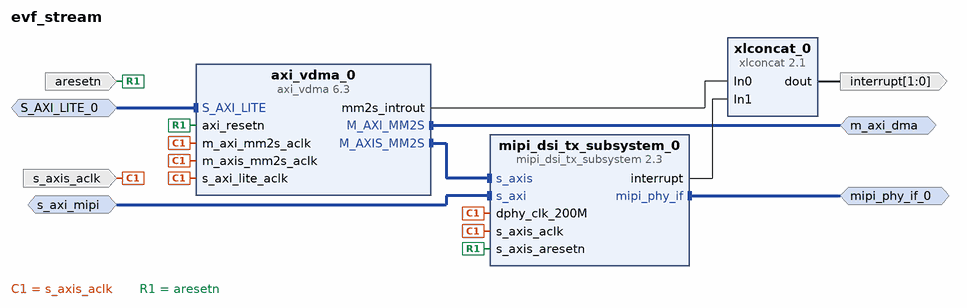
[diagram p0: block diagram of the top level]
# Vivado block design evf_stream, xc7z014sclg484-1, Vivado 2023.1
create_bd_design evf_stream

create_bd_intf_port -mode Master -vlnv xilinx.com:interface:mipi_phy_rtl:1.0 mipi_phy_if_0
create_bd_intf_port -mode Master -vlnv xilinx.com:interface:aximm_rtl:1.0 m_axi_dma
set_property -dict [list \
  CONFIG.ADDR_WIDTH 32 \
  CONFIG.DATA_WIDTH 128 \
  CONFIG.FREQ_HZ 200000000 \
  CONFIG.HAS_BRESP 0 \
  CONFIG.HAS_BURST 0 \
  CONFIG.HAS_LOCK 0 \
  CONFIG.HAS_QOS 0 \
  CONFIG.HAS_REGION 0 \
  CONFIG.HAS_WSTRB 0 \
  CONFIG.NUM_READ_OUTSTANDING 16 \
  CONFIG.NUM_WRITE_OUTSTANDING 2 \
  CONFIG.PROTOCOL AXI4 \
  CONFIG.READ_WRITE_MODE READ_ONLY \
] [get_bd_intf_ports m_axi_dma]
create_bd_intf_port -mode Slave -vlnv xilinx.com:interface:aximm_rtl:1.0 s_axi_mipi
set_property -dict [list \
  CONFIG.ADDR_WIDTH 16 \
  CONFIG.ARUSER_WIDTH 0 \
  CONFIG.AWUSER_WIDTH 0 \
  CONFIG.BUSER_WIDTH 0 \
  CONFIG.DATA_WIDTH 32 \
  CONFIG.FREQ_HZ 200000000 \
  CONFIG.HAS_BRESP 1 \
  CONFIG.HAS_BURST 0 \
  CONFIG.HAS_CACHE 0 \
  CONFIG.HAS_LOCK 0 \
  CONFIG.HAS_PROT 0 \
  CONFIG.HAS_QOS 0 \
  CONFIG.HAS_REGION 0 \
  CONFIG.HAS_RRESP 1 \
  CONFIG.HAS_WSTRB 1 \
  CONFIG.ID_WIDTH 0 \
  CONFIG.MAX_BURST_LENGTH 1 \
  CONFIG.NUM_READ_OUTSTANDING 1 \
  CONFIG.NUM_READ_THREADS 1 \
  CONFIG.NUM_WRITE_OUTSTANDING 1 \
  CONFIG.NUM_WRITE_THREADS 1 \
  CONFIG.PROTOCOL AXI4LITE \
  CONFIG.READ_WRITE_MODE READ_WRITE \
  CONFIG.RUSER_BITS_PER_BYTE 0 \
  CONFIG.RUSER_WIDTH 0 \
  CONFIG.SUPPORTS_NARROW_BURST 0 \
  CONFIG.WUSER_BITS_PER_BYTE 0 \
  CONFIG.WUSER_WIDTH 0 \
] [get_bd_intf_ports s_axi_mipi]
create_bd_intf_port -mode Slave -vlnv xilinx.com:interface:aximm_rtl:1.0 S_AXI_LITE_0
set_property -dict [list \
  CONFIG.ADDR_WIDTH 9 \
  CONFIG.ARUSER_WIDTH 0 \
  CONFIG.AWUSER_WIDTH 0 \
  CONFIG.BUSER_WIDTH 0 \
  CONFIG.DATA_WIDTH 32 \
  CONFIG.FREQ_HZ 200000000 \
  CONFIG.HAS_BRESP 1 \
  CONFIG.HAS_BURST 0 \
  CONFIG.HAS_CACHE 0 \
  CONFIG.HAS_LOCK 0 \
  CONFIG.HAS_PROT 0 \
  CONFIG.HAS_QOS 0 \
  CONFIG.HAS_REGION 0 \
  CONFIG.HAS_RRESP 1 \
  CONFIG.HAS_WSTRB 0 \
  CONFIG.ID_WIDTH 0 \
  CONFIG.MAX_BURST_LENGTH 1 \
  CONFIG.NUM_READ_OUTSTANDING 2 \
  CONFIG.NUM_READ_THREADS 1 \
  CONFIG.NUM_WRITE_OUTSTANDING 2 \
  CONFIG.NUM_WRITE_THREADS 1 \
  CONFIG.PROTOCOL AXI4LITE \
  CONFIG.READ_WRITE_MODE READ_WRITE \
  CONFIG.RUSER_BITS_PER_BYTE 0 \
  CONFIG.RUSER_WIDTH 0 \
  CONFIG.SUPPORTS_NARROW_BURST 0 \
  CONFIG.WUSER_BITS_PER_BYTE 0 \
  CONFIG.WUSER_WIDTH 0 \
] [get_bd_intf_ports S_AXI_LITE_0]
create_bd_port -dir I -type rst aresetn
create_bd_port -dir I -type clk s_axis_aclk
set_property -dict [list \
  CONFIG.ASSOCIATED_BUSIF m_axi_dma:s_axi_mipi:S_AXI_LITE_0 \
  CONFIG.ASSOCIATED_RESET aresetn \
  CONFIG.FREQ_HZ 200000000 \
] [get_bd_ports s_axis_aclk]
create_bd_port -dir O -from 1 -to 0 interrupt

create_bd_cell -type ip -vlnv xilinx.com:ip:mipi_dsi_tx_subsystem:2.3 mipi_dsi_tx_subsystem_0
set_property -dict [list \
  CONFIG.C_EN_7S_LINERATE_CHECK true \
  CONFIG.C_EN_HS_OBUFTDS false \
  CONFIG.C_INCLUDE_DCS_CMD_MODE false \
  CONFIG.DPHY_EN_REG_IF false \
  CONFIG.DSI_DATATYPE RGB888 \
  CONFIG.DSI_LANES 4 \
  CONFIG.DSI_PIXELS 4 \
  CONFIG.SupportLevel 1 \
] [get_bd_cells mipi_dsi_tx_subsystem_0]
create_bd_cell -type ip -vlnv xilinx.com:ip:xlconcat:2.1 xlconcat_0
create_bd_cell -type ip -vlnv xilinx.com:ip:axi_vdma:6.3 axi_vdma_0
set_property -dict [list \
  CONFIG.c_include_s2mm 0 \
  CONFIG.c_m_axis_mm2s_tdata_width 96 \
  CONFIG.c_mm2s_genlock_mode 0 \
  CONFIG.c_num_fstores 1 \
] [get_bd_cells axi_vdma_0]

# ---- connections ----

connect_bd_intf_net -intf_net S_AXI_LITE_0_1 [get_bd_intf_ports S_AXI_LITE_0] [get_bd_intf_pins axi_vdma_0/S_AXI_LITE]
connect_bd_intf_net [get_bd_intf_pins axi_vdma_0/M_AXIS_MM2S] [get_bd_intf_pins mipi_dsi_tx_subsystem_0/s_axis]
connect_bd_intf_net [get_bd_intf_ports m_axi_dma] [get_bd_intf_pins axi_vdma_0/M_AXI_MM2S]
connect_bd_intf_net [get_bd_intf_ports mipi_phy_if_0] [get_bd_intf_pins mipi_dsi_tx_subsystem_0/mipi_phy_if]
connect_bd_intf_net -intf_net s_axi_0_1 [get_bd_intf_ports s_axi_mipi] [get_bd_intf_pins mipi_dsi_tx_subsystem_0/s_axi]
connect_bd_net [get_bd_pins axi_vdma_0/mm2s_introut] [get_bd_pins xlconcat_0/In0]
connect_bd_net [get_bd_pins mipi_dsi_tx_subsystem_0/interrupt] [get_bd_pins xlconcat_0/In1]
connect_bd_net -net s_axis_aclk_0_1 [get_bd_ports s_axis_aclk] \
  [get_bd_pins mipi_dsi_tx_subsystem_0/s_axis_aclk] [get_bd_pins axi_vdma_0/s_axi_lite_aclk] \
  [get_bd_pins axi_vdma_0/m_axi_mm2s_aclk] [get_bd_pins axi_vdma_0/m_axis_mm2s_aclk] \
  [get_bd_pins mipi_dsi_tx_subsystem_0/dphy_clk_200M]
connect_bd_net -net s_axis_aresetn_0_1 [get_bd_ports aresetn] [get_bd_pins mipi_dsi_tx_subsystem_0/s_axis_aresetn] [get_bd_pins axi_vdma_0/axi_resetn]
connect_bd_net [get_bd_pins xlconcat_0/dout] [get_bd_ports interrupt]

# ---- address map ----
assign_bd_address -offset 0x44A00000 -range 64K -target_address_space [get_bd_addr_spaces axi_vdma_0/Data_MM2S] [get_bd_addr_segs m_axi_dma/Reg]
assign_bd_address -offset 0x0000 -range 64K -target_address_space [get_bd_addr_spaces s_axi_mipi] [get_bd_addr_segs mipi_dsi_tx_subsystem_0/s_axi/Reg]

validate_bd_design
save_bd_design
